# EAGLE design tastatur (EAGLE 6.3)
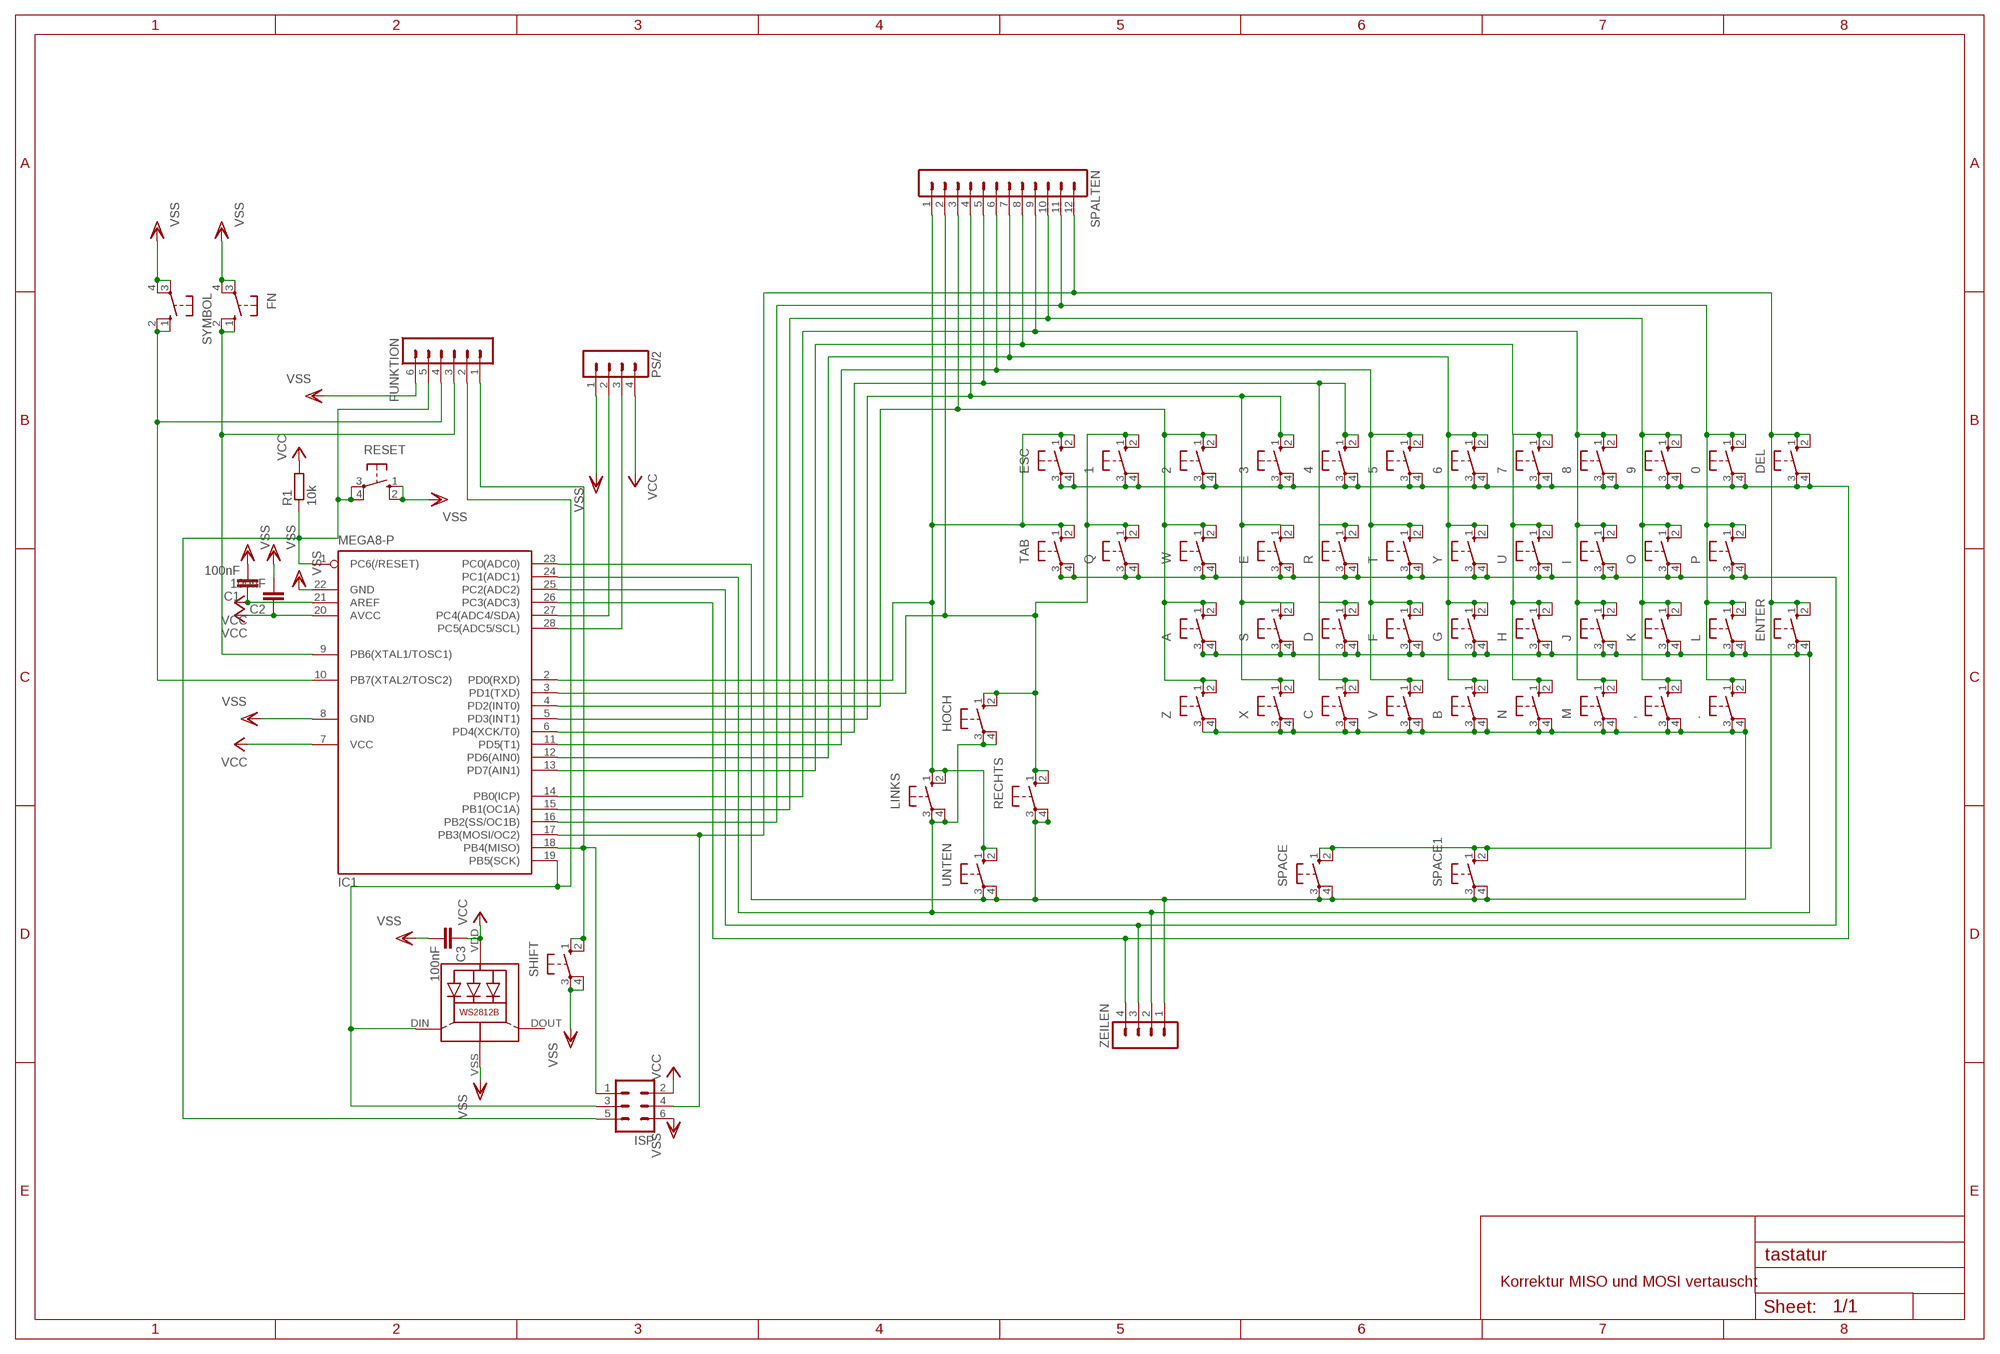
[diagram p0: schematic, sheet 1]

## Parts
0  40-XX  [B3F-40XX]
1  40-XX  [B3F-40XX]
2  40-XX  [B3F-40XX]
3  40-XX  [B3F-40XX]
4  40-XX  [B3F-40XX]
5  40-XX  [B3F-40XX]
6  40-XX  [B3F-40XX]
7  40-XX  [B3F-40XX]
8  40-XX  [B3F-40XX]
9  40-XX  [B3F-40XX]
,  40-XX  [B3F-40XX]
.  40-XX  [B3F-40XX]
A  40-XX  [B3F-40XX]
B  40-XX  [B3F-40XX]
C  40-XX  [B3F-40XX]
C1  100nF  C-EU025-025X050  [C025-025X050]
C2  100nF  C-EU025-025X050  [C025-025X050]
C3  100nF  C-EU025-025X050  [C025-025X050]
D  40-XX  [B3F-40XX]
DEL  40-XX  [B3F-40XX]
E  40-XX  [B3F-40XX]
ENTER  40-XX  [B3F-40XX]
ESC  40-XX  [B3F-40XX]
F  40-XX  [B3F-40XX]
FN  40-XX  [B3F-40XX]
FUNKTION  MA06-1  [MA06-1]
G  40-XX  [B3F-40XX]
H  40-XX  [B3F-40XX]
HOCH  40-XX  [B3F-40XX]
I  40-XX  [B3F-40XX]
IC1  MEGA8-P  [DIL28-3]
ISP  ML6L  [ML6L]
J  40-XX  [B3F-40XX]
K  40-XX  [B3F-40XX]
L  40-XX  [B3F-40XX]
LED1  WS2812B  [WS2812B]
LINKS  40-XX  [B3F-40XX]
M  40-XX  [B3F-40XX]
N  40-XX  [B3F-40XX]
O  40-XX  [B3F-40XX]
P  40-XX  [B3F-40XX]
PS/2  MA04-1  [MA04-1]
Q  40-XX  [B3F-40XX]
R  40-XX  [B3F-40XX]
R1  10k  R-EU_0204/7  [0204/7]
RECHTS  40-XX  [B3F-40XX]
RESET  10-XX  [B3F-10XX]
S  40-XX  [B3F-40XX]
SHIFT  40-XX  [B3F-40XX]
SPACE  40-XX  [B3F-40XX]
SPACE1  40-XX  [B3F-40XX]
SPALTEN  MA12-1  [MA12-1]
SYMBOL  40-XX  [B3F-40XX]
T  40-XX  [B3F-40XX]
TAB  40-XX  [B3F-40XX]
U  40-XX  [B3F-40XX]
UNTEN  40-XX  [B3F-40XX]
V  40-XX  [B3F-40XX]
W  40-XX  [B3F-40XX]
X  40-XX  [B3F-40XX]
Y  40-XX  [B3F-40XX]
Z  40-XX  [B3F-40XX]
ZEILEN  MA04-1  [MA04-1]

## Nets
A0: ,.3(P) ,.4(P1) ..3(P) ..4(P1) B.3(P) B.4(P1) C.3(P) C.4(P1) IC1.23(PC0(ADC0)) M.3(P) M.4(P1) N.3(P) N.4(P1) RECHTS.3(P) RECHTS.4(P1) SPACE1.3(P) SPACE1.4(P1) SPACE.3(P) SPACE.4(P1) UNTEN.3(P) UNTEN.4(P1) V.3(P) V.4(P1) X.3(P) X.4(P1) Z.3(P) Z.4(P1) ZEILEN.1
A1: A.3(P) A.4(P1) D.3(P) D.4(P1) ENTER.3(P) ENTER.4(P1) F.3(P) F.4(P1) G.3(P) G.4(P1) H.3(P) H.4(P1) HOCH.3(P) HOCH.4(P1) IC1.24(PC1(ADC1)) J.3(P) J.4(P1) K.3(P) K.4(P1) L.3(P) L.4(P1) LINKS.3(P) LINKS.4(P1) S.3(P) S.4(P1) ZEILEN.2
A2: E.3(P) E.4(P1) I.3(P) I.4(P1) IC1.25(PC2(ADC2)) O.3(P) O.4(P1) P.3(P) P.4(P1) Q.3(P) Q.4(P1) R.3(P) R.4(P1) T.3(P) T.4(P1) TAB.3(P) TAB.4(P1) U.3(P) U.4(P1) W.3(P) W.4(P1) Y.3(P) Y.4(P1) ZEILEN.3
A3: 0.3(P) 0.4(P1) 1.3(P) 1.4(P1) 2.3(P) 2.4(P1) 3.3(P) 3.4(P1) 4.3(P) 4.4(P1) 5.3(P) 5.4(P1) 6.3(P) 6.4(P1) 7.3(P) 7.4(P1) 8.3(P) 8.4(P1) 9.3(P) 9.4(P1) DEL.3(P) DEL.4(P1) ESC.3(P) ESC.4(P1) IC1.26(PC3(ADC3)) ZEILEN.4
CLK: IC1.27(PC4(ADC4/SDA)) PS/2.2
D0: ESC.1(S) ESC.2(S1) IC1.2(PD0(RXD)) LINKS.1(S) LINKS.2(S1) SPALTEN.1 TAB.1(S) TAB.2(S1) UNTEN.1(S) UNTEN.2(S1)
D1: 1.1(S) 1.2(S1) HOCH.1(S) HOCH.2(S1) IC1.3(PD1(TXD)) Q.1(S) Q.2(S1) RECHTS.1(S) RECHTS.2(S1) SPALTEN.2
D2: 2.1(S) 2.2(S1) A.1(S) A.2(S1) IC1.4(PD2(INT0)) SPALTEN.3 W.1(S) W.2(S1) Z.1(S) Z.2(S1)
D3: 3.1(S) 3.2(S1) E.1(S) E.2(S1) IC1.5(PD3(INT1)) S.1(S) S.2(S1) SPALTEN.4 X.1(S) X.2(S1)
D4: 4.1(S) 4.2(S1) C.1(S) C.2(S1) D.1(S) D.2(S1) IC1.6(PD4(XCK/T0)) R.1(S) R.2(S1) SPALTEN.5
D5: 5.1(S) 5.2(S1) F.1(S) F.2(S1) IC1.11(PD5(T1)) SPALTEN.6 T.1(S) T.2(S1) V.1(S) V.2(S1)
D6: 6.1(S) 6.2(S1) B.1(S) B.2(S1) G.1(S) G.2(S1) IC1.12(PD6(AIN0)) SPALTEN.7 Y.1(S) Y.2(S1)
D7: 7.1(S) 7.2(S1) H.1(S) H.2(S1) IC1.13(PD7(AIN1)) N.1(S) N.2(S1) SPALTEN.8 U.1(S) U.2(S1)
D8: 8.1(S) 8.2(S1) I.1(S) I.2(S1) IC1.14(PB0(ICP)) J.1(S) J.2(S1) M.1(S) M.2(S1) SPALTEN.9
D9: 9.1(S) 9.2(S1) ,.1(S) ,.2(S1) IC1.15(PB1(OC1A)) K.1(S) K.2(S1) O.1(S) O.2(S1) SPALTEN.10
D10: 0.1(S) 0.2(S1) ..1(S) ..2(S1) IC1.16(PB2(SS/OC1B)) L.1(S) L.2(S1) P.1(S) P.2(S1) SPALTEN.11
D11: DEL.1(S) DEL.2(S1) ENTER.1(S) ENTER.2(S1) IC1.17(PB3(MOSI/OC2)) ISP.4 SPACE1.1(S) SPACE1.2(S1) SPACE.1(S) SPACE.2(S1) SPALTEN.12
DAT: IC1.28(PC5(ADC5/SCL)) PS/2.3
DIN: FUNKTION.2 IC1.19(PB5(SCK)) ISP.3 LED1.DIN(DI)
FN: FN.1(S) FN.2(S1) FUNKTION.3 IC1.9(PB6(XTAL1/TOSC1))
RESET: FUNKTION.5 IC1.1(PC6(/RESET)) ISP.5 R1.1 RESET.3(P) RESET.4(P1)
SHIFT: FUNKTION.1 IC1.18(PB4(MISO)) ISP.1 SHIFT.1(S) SHIFT.2(S1)
SYMBOL: FUNKTION.4 IC1.10(PB7(XTAL2/TOSC2)) SYMBOL.1(S) SYMBOL.2(S1)
VCC: C1.1 C2.1 C3.1 IC1.7(VCC) IC1.20(AVCC) IC1.21(AREF) ISP.2 LED1.VDD PS/2.4 R1.2
VSS: C1.2 C2.2 C3.2 FN.3(P) FN.4(P1) FUNKTION.6 IC1.8(GND) IC1.22(GND) ISP.6 LED1.VSS(GND) PS/2.1 RESET.1(S) RESET.2(S1) SHIFT.3(P) SHIFT.4(P1) SYMBOL.3(P) SYMBOL.4(P1)
Unconnected: LED1.DOUT(DO)

## Notes on the sheet
- Korrektur MISO und MOSI vertauscht

## Library data of the parts
0 1-9 , . A B C D DEL E ENTER ESC F FN G H HOCH I J K L LINKS M N O P Q R RECHTS S SHIFT SPACE SPACE1 SYMBOL T TAB U UNTEN V W X Y Z = switch-omron:40-XX: OMRON SWITCH; MF: OMRON COMPONENTS USA; MPN: B3F-4000; OC_FARNELL: 176434; OC_NEWARK: 36K3105
C1-C3 = rcl:C-EU: CAPACITOR, European symbol
FUNKTION = con-lstb:MA06-1: PIN HEADER; OC_FARNELL: unknown; OC_NEWARK: unknown
IC1 = atmel:MEGA8-P: MICROCONTROLLER 8 Kbytes FLASH, 1 kbytes SRAM, 512 bytes EEPROM, USART, 4-channel 10 bit ADC, 2-channel 8 bit ADC Pin compatible with Atmega48, ATMega88, ATMega168 Source: avr.lbr; OC_FARNELL: unknown; OC_NEWARK: unknown
ISP = con-ml:ML6L: HARTING; OC_FARNELL: unknown; OC_NEWARK: unknown
LED1 = WS2812B:WS2812B: Features and Benefits  * Intelligent reverse connect protection, the power supply reverse connection does not damage the IC. * The control circuit and the LED share the only power source. Control circuit and RGB chip are integrated in a package of 5050 components, form a complete control of pixel point.  * Built-in signal reshaping circuit, after wave reshaping to the next driver, ensure wave-form distortion not accumulate.  * Built-in electric reset circuit and power lost reset circuit.  * Each pixel of the three primary color can achieve 256 brightness display, completed 16777216 color full color display, and scan frequency not less than 400Hz/s.  * Cascading port transmission signal by single line.  * Any two point the distance more than 5m transmission signal without any increase circuit.  * When the refresh rate is 30fps, cascade number are not less than1024 points.  * Send data at speeds of 800Kbps.  *The color of the light were highly consistent, cost-effective. Applications  Full-color module, Full color soft lights a lamp strip. LED decorative lighting, Indoor/outdoor LED video irregular screen. General description WS2812B is a intelligent control LED light source that the control circuit and RGB chip are integrated in a package of 5050 components. It internal include intelligent digital port data latch and signal reshaping amplification drive circuit. Also include a precision internal oscillator and a 12V voltage programmable constant curre-nt control part, effectively ensuring the pixel point light color height consistent. The data transfer protocol use single NZR communication mode. After the pixel power-on reset, the DIN port receive data from controller, the first pixel collect initial 24bit data then sent to the internal data latch, the other data which reshaping by the internal signal reshaping amplification circuit sent to the next cascade pixel through the DO port. After transmission for each pixel,the signal to reduce 24bit. pixel adopt auto reshaping transmit technology, making the pixel cascade number is not limited the signal transmission, only depend on the speed of signal transmission. LED with low driving voltage, environmental protection and energy saving, high brightness, scattering angle is large, good consistency, low power, long life and other advantages. The control chip integrated in LED above becoming more simple circuit, small volume, convenient installation. Absolute Maximum Ratings Power supply voltage: VDD +3.5V..+5.3V Input voltage: VI -0.5V..VDD+0.5V based on WS2812 from https://github.com/adafruit/Adafruit-Eagle-Library
PS/2 ZEILEN = con-lstb:MA04-1: PIN HEADER; OC_FARNELL: unknown; OC_NEWARK: unknown
R1 = rcl:R-EU_: RESISTOR, European symbol
RESET = switch-omron:10-XX: OMRON SWITCH; MPN: B3F-1000; OC_FARNELL: 176432; OC_NEWARK: 36M3542
SPALTEN = con-lstb:MA12-1: PIN HEADER; OC_FARNELL: unknown; OC_NEWARK: unknown

## Board
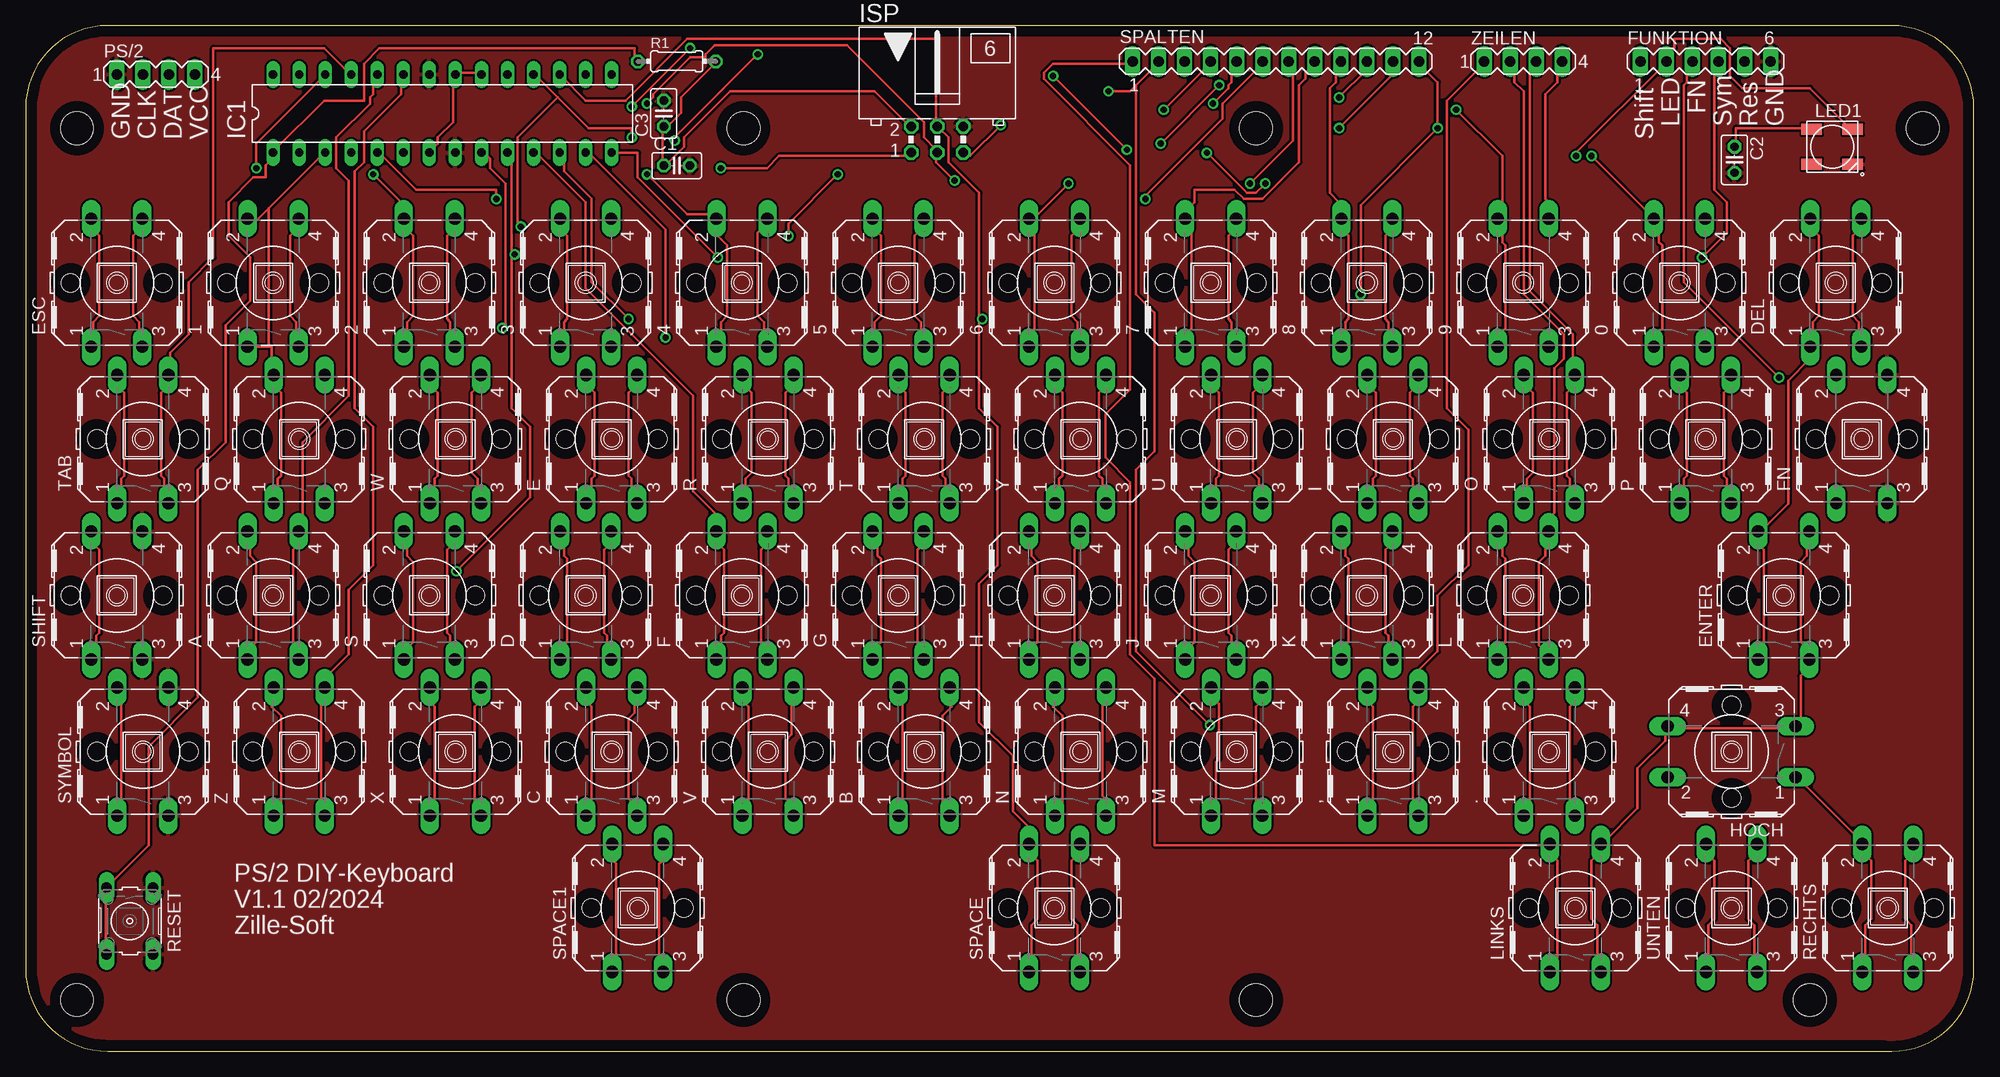
[diagram p1: board, top side]
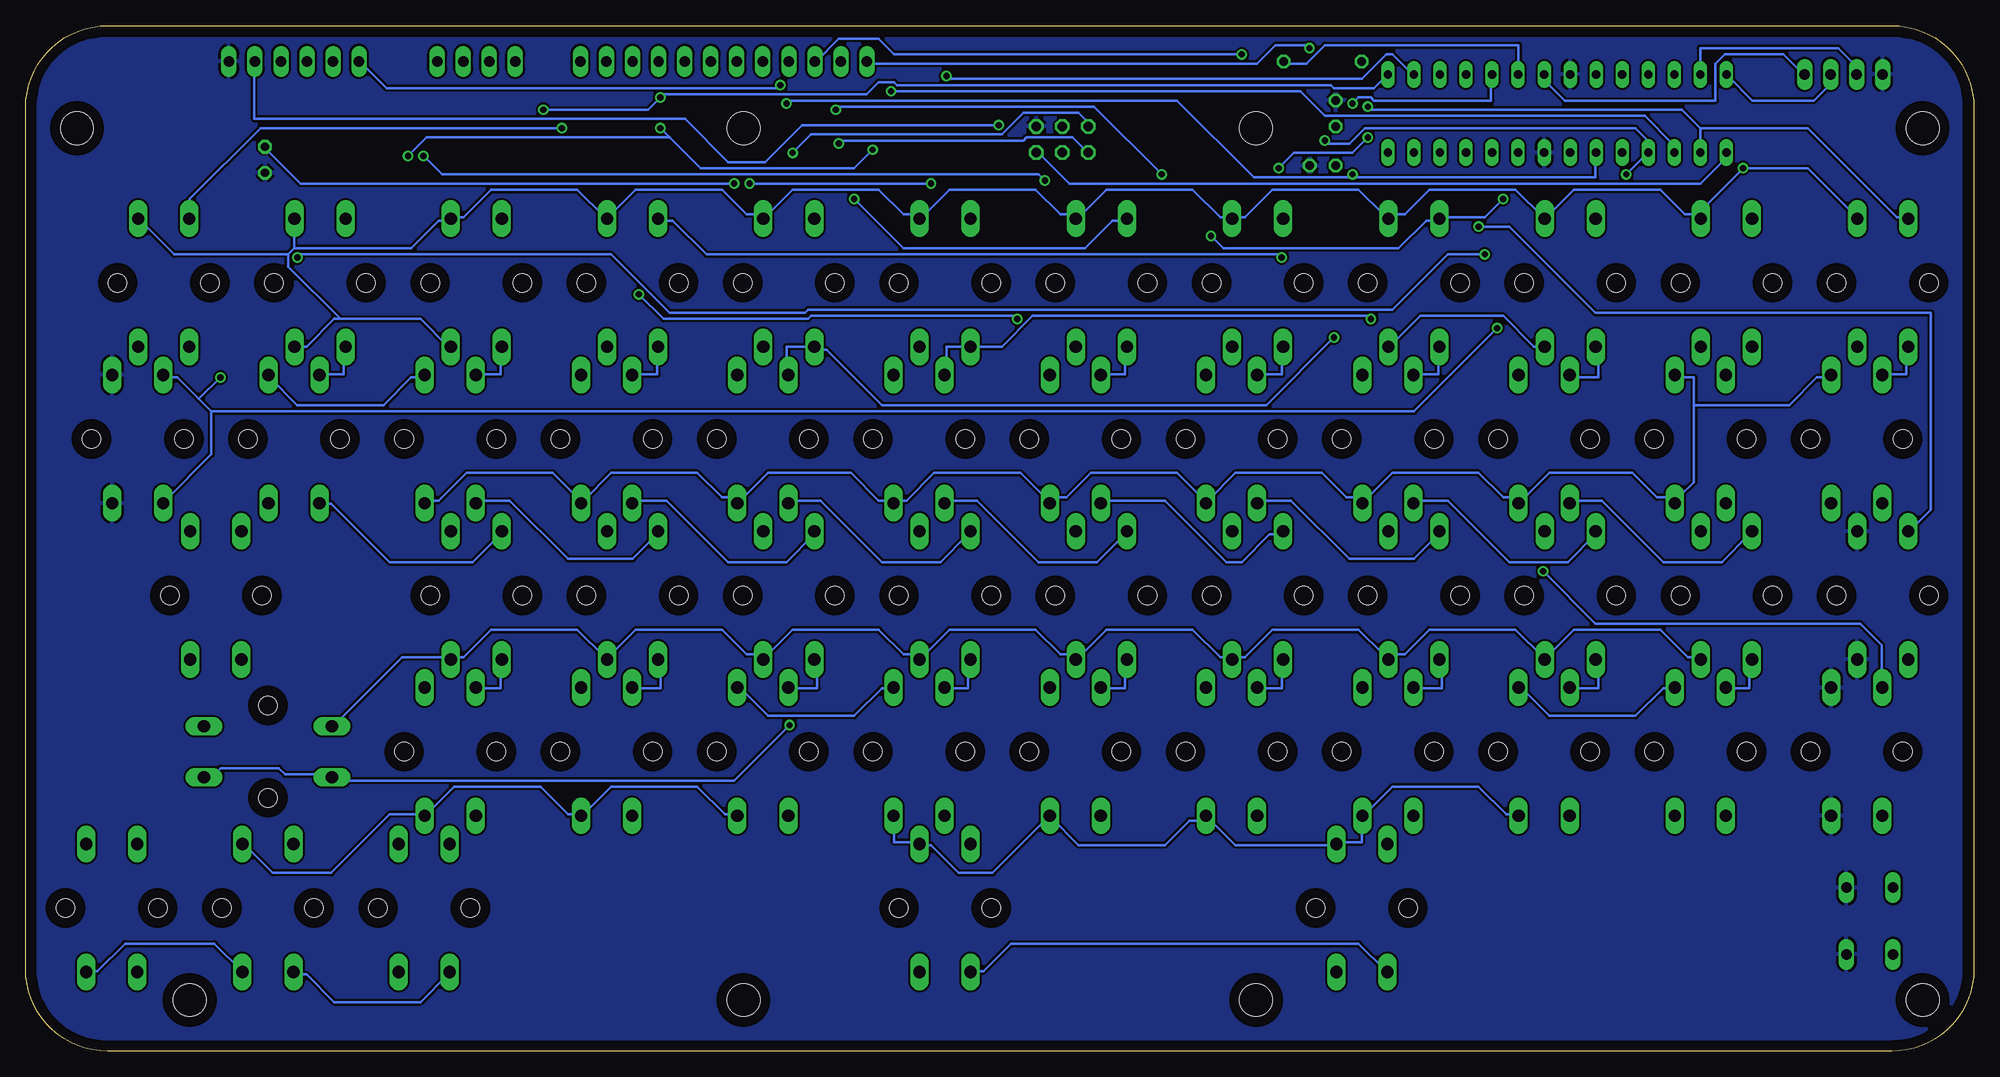
[diagram p2: board, bottom side, seen from below]

Size 190 x 100 mm. Coordinates in mm from the lower left corner, seen from the top.
Outline: 190,8 190,92 arc90 182,100 8,100 arc90 0,92 0,8 arc90 8,0 182,0 arc90 190,8
Copper layers (1*16): Top 0.035mm / dielectric 1.5mm / Bottom 0.035mm
Design rules "default": minimum track width 10mil, minimum drill 24mil, track to track 8mil, track to pad 8mil, pad to pad 8mil, via to via 8mil, smd to smd 8mil, copper to edge 40mil, drill to drill 8mil, minimum pad ring 10mil, minimum via ring 8mil, stop-mask expansion 4mil, vias tented up to drill 0mil, thermal gap 10mil
Holes 3.2 mm at 5,90 5,5 174,5 185,90 70,5 120,5 120,90 70,90

### Footprints (pad centres in the part's own frame; a part is rotated, then mirrored left to right if it is on the bottom)
B3F-40XX = drill 1.194 long: 1 -6.248,2.489; 2 6.248,2.489; 3 -6.248,-2.489; 4 6.248,-2.489 | hole 1.803: 0,-4.496; 0,4.496
C025-025X050 = drill 0.813 octagon: 1 -1.27,0; 2 1.27,0
MA06-1 = drill 1.016 long: 1 -6.35,0; 2 -3.81,0; 3 -1.27,0; 4 1.27,0; 5 3.81,0; 6 6.35,0
DIL28-3 = drill 0.813 long: 1 -16.51,-3.81; 2 -13.97,-3.81; 3 -11.43,-3.81; 4 -8.89,-3.81; 5 -6.35,-3.81; 6 -3.81,-3.81; 7 -1.27,-3.81; 8 1.27,-3.81; 9 3.81,-3.81; 10 6.35,-3.81; 11 8.89,-3.81; 12 11.43,-3.81; 13 13.97,-3.81; 14 16.51,-3.81; 15 16.51,3.81; 16 13.97,3.81; 17 11.43,3.81; 18 8.89,3.81; 19 6.35,3.81; 20 3.81,3.81; 21 1.27,3.81; 22 -1.27,3.81; 23 -3.81,3.81; 24 -6.35,3.81; 25 -8.89,3.81; 26 -11.43,3.81; 27 -13.97,3.81; 28 -16.51,3.81
ML6L = drill 0.914 octagon: 1 -2.54,-1.27; 2 -2.54,1.27; 3 0,-1.27; 4 0,1.27; 5 2.54,-1.27; 6 2.54,1.27
WS2812B = smd 2 x 1.1: DIN 2,1.7; DOUT -2,-1.7; VDD -2,1.7; VSS 2,-1.7
MA04-1 = drill 1.016 long: 1 -3.81,0; 2 -1.27,0; 3 1.27,0; 4 3.81,0
0204/7 = drill 0.813 octagon: 1 -3.81,0; 2 3.81,0
B3F-10XX = drill 1.016 long: 1 -3.251,2.261; 2 3.251,2.261; 3 -3.251,-2.261; 4 3.251,-2.261
MA12-1 = drill 1.016 long: 1 -13.97,0; 2 -11.43,0; 3 -8.89,0; 4 -6.35,0; 5 -3.81,0; 6 -1.27,0; 7 1.27,0; 8 3.81,0; 9 6.35,0; 10 8.89,0; 11 11.43,0; 12 13.97,0

### Placement (x,y rotation side)
0  161.29,74.93 90 top
1  24.13,74.93 90 top
2  39.37,74.93 90 top
3  54.61,74.93 90 top
4  69.85,74.93 90 top
5  85.09,74.93 90 top
6  100.33,74.93 90 top
7  115.57,74.93 90 top
8  130.81,74.93 90 top
9  146.05,74.93 90 top
,  133.35,29.21 90 top
.  148.59,29.21 90 top
A  24.13,44.45 90 top
B  87.63,29.21 90 top
C  57.15,29.21 90 top
C1  63.5,86.36 0 top
C2  166.65,86.92 270 top
C3  62.23,91.44 90 top
D  54.61,44.45 90 top
DEL  176.53,74.93 90 top
E  57.15,59.69 90 top
ENTER  171.45,44.45 90 top
ESC  8.89,74.93 90 top
F  69.85,44.45 90 top
FN  179.07,59.69 90 top
FUNKTION  163.83,96.52 0 top
G  85.09,44.45 90 top
H  100.33,44.45 90 top
HOCH  166.37,29.21 180 top
I  133.35,59.69 90 top
IC1  40.64,91.44 0 top
ISP  88.9,88.9 0 top
J  115.57,44.45 90 top
K  130.81,44.45 90 top
L  146.05,44.45 90 top
LED1  176.19,88.19 0 top
LINKS  151.13,13.97 90 top
M  118.11,29.21 90 top
N  102.87,29.21 90 top
O  148.59,59.69 90 top
P  163.83,59.69 90 top
PS/2  12.7,95.25 0 top
Q  26.67,59.69 90 top
R  72.39,59.69 90 top
R1  63.5,96.52 0 top
RECHTS  181.61,13.97 90 top
RESET  10.16,12.7 270 top
S  39.37,44.45 90 top
SHIFT  8.89,44.45 90 top
SPACE  100.33,13.97 90 top
SPACE1  59.69,13.97 90 top
SPALTEN  121.92,96.52 0 top
SYMBOL  11.43,29.21 90 top
T  87.63,59.69 90 top
TAB  11.43,59.69 90 top
U  118.11,59.69 90 top
UNTEN  166.37,13.97 90 top
V  72.39,29.21 90 top
W  41.91,59.69 90 top
X  41.91,29.21 90 top
Y  102.87,59.69 90 top
Z  26.67,29.21 90 top
ZEILEN  146.05,96.52 0 top

### Tracks (layer width: path | path; a pad name or v marks a point on that pad's centre or on a via)
A0
  Top 0.254: UNTEN.3 168.6,7.8 168.6,12.3 168,12.9 168,18.6 168.6,19.2 168.6,20.1 UNTEN.4 | RECHTS.3 183.9,7.8 183.9,12.3 183.3,12.9 183.3,18.6 183.9,19.2 183.9,20.1 RECHTS.4 | ..3 150.9,23.1 150.6,23.4 150.6,33.6 150.9,33.9 150.9,35.4 ..4 | ZEILEN.1 142.2,96.3 138.6,92.7 138.6,62.7 140.7,60.6 140.7,47.4 137.7,44.4 137.7,39 135.9,37.2 135.9,35.7 ,.4 135.6,35.4 135.6,33.9 135.3,33.6 135.3,23.4 135.6,23.1 ,.3 | M.3 120.3,23.1 120,23.4 120,33.6 120.3,33.9 120.3,35.4 M.4 | B.3 90,23.1 89.4,23.7 89.4,32.7 90.3,33.6 90.3,35.4 B.4 | SPACE.3 102.6,7.8 102.6,12.3 102,12.9 102,18.6 102.6,19.2 102.6,20.1 SPACE.4 | N.4 105.3,35.4 105,35.1 105,24.9 105.3,24.6 105.3,23.1 N.3 | SPACE1.3 62.1,7.8 61.8,8.1 61.8,18.3 62.1,18.6 62.1,20.1 SPACE1.4 | C.4 59.4,35.4 59.4,33 58.8,32.4 58.8,24.6 59.4,24 59.4,23.1 C.3 | V.4 74.7,35.4 74.7,30.9 74.1,30.3 74.1,24.6 74.7,24 74.7,23.1 V.3 | X.3 44.1,23.1 43.8,23.4 43.8,33.6 44.1,33.9 44.1,35.4 X.4 | IC1.23 36.6,95.1 36.6,93.3 33,89.7 33,86.7 32.1,85.8 32.1,62.7 33.9,60.9 33.9,47.4 31.5,45 31.5,38.7 29.4,36.6 29.4,35.7 Z.4 29.1,35.4 28.8,35.1 28.8,23.4 29.1,23.1 Z.3
  Bottom 0.254: UNTEN.3 168.9,7.8 171.6,10.5 180.3,10.5 183,7.8 183.9,7.8 RECHTS.3 | UNTEN.4 168.6,20.1 165.9,17.4 160.2,17.4 154.5,23.1 151.2,23.1 ..3 150.9,23.1 148.2,25.8 139.8,25.8 137.1,23.1 135.9,23.1 ,.3 135.6,23.1 132.9,25.8 124.5,25.8 121.8,23.1 120.6,23.1 M.3 | N.3 105.3,22.8 105.3,20.4 102.9,20.4 SPACE.4 102.6,20.1 101.7,20.1 99,17.4 95.7,17.4 90.3,22.8 B.3 90,22.8 87.3,20.1 78.9,20.1 76.5,22.5 74.4,22.5 | M.4 120.3,35.4 117.6,32.7 109.2,32.7 106.5,35.4 105.6,35.4 N.4 | 74.4,22.5 72,20.1 62.4,20.1 SPACE1.4 62.1,20.4 59.7,20.4 59.7,22.8 C.3 59.4,23.1 56.7,25.8 48.3,25.8 45.6,23.1 44.4,23.1 X.3 | 74.4,22.5 74.7,22.8 V.3 74.4,22.5 | X.4 44.1,35.4 41.4,32.7 33,32.7 30.3,35.4 29.4,35.4 Z.4
A1
  Top 0.254: ZEILEN.2 144.9,96.3 145.2,96 145.2,94.5 146.1,93.6 146.1,73.8 150,69.9 150,67.5 149.1,66.6 149.1,52.5 148.8,52.2 148.8,50.7 L.4 148.5,50.4 148.2,50.1 148.2,48.3 147.6,47.7 147.6,39.6 148.5,38.7 148.5,38.4 L.3 | ENTER.4 173.7,50.4 173.7,48.3 173.1,47.7 173.1,39.9 173.7,39.3 173.7,38.4 ENTER.3 173.7,38.1 173.7,37.2 173.1,36.6 173.1,32.1 172.8,31.8 HOCH.3 172.5,31.5 160.2,31.5 HOCH.4 159.9,31.5 159.9,30.3 157.2,27.6 157.2,23.7 153.9,20.4 LINKS.4 153.6,20.1 153.6,19.5 152.7,18.6 152.7,12.9 153.3,12.3 153.3,8.1 153.6,7.8 LINKS.3 | K.3 133.2,38.4 132.9,38.7 132.9,40.5 132.6,40.8 132.6,48.9 133.2,49.5 133.2,50.4 K.4 | S.3 41.7,38.4 41.4,38.7 41.4,40.5 41.1,40.8 41.1,48.9 41.7,49.5 41.7,50.4 S.4 | IC1.24 34.2,95.1 33.9,94.8 33.9,93.3 33.6,93 33.6,92.4 30.3,89.1 30.3,86.1 31.5,84.9 31.5,63.9 27,59.4 27,51 26.7,50.7 A.4 26.4,50.4 26.4,49.2 26.1,48.9 26.1,38.7 26.4,38.4 A.3 | J.3 117.9,38.4 117.6,38.7 117.6,40.5 117.3,40.8 117.3,48.9 117.9,49.5 117.9,50.4 J.4 | H.3 102.6,38.4 102.3,38.7 102.3,48.9 102.6,49.2 102.6,50.4 H.4 | G.3 87.3,38.4 87,38.7 87,48.9 87.3,49.2 87.3,50.4 G.4 | D.3 57,38.4 56.7,38.7 56.7,40.5 56.4,40.8 56.4,48.9 57,49.5 57,50.4 D.4 | F.3 72.3,38.4 71.7,39 71.7,48.9 72.3,49.5 72.3,50.4 F.4
  Bottom 0.254: HOCH.4 159.9,31.8 153.3,38.4 148.8,38.4 L.3 148.5,38.4 147.3,38.4 144.6,41.1 136.2,41.1 133.5,38.4 K.3 133.2,38.4 130.5,41.1 122.1,41.1 119.7,38.7 117.6,38.7 | A.3 26.7,38.4 27.9,38.4 30.6,41.1 39,41.1 41.7,38.4 S.3 42,38.4 44.7,41.1 53.1,41.1 55.5,38.7 57.6,38.7 | 57.6,38.7 60,41.1 68.4,41.1 71.1,38.4 72.3,38.4 F.3 72.6,38.4 73.5,38.4 76.2,41.1 84.6,41.1 87,38.7 | 57.6,38.7 57.3,38.4 D.3 57.6,38.7 | 87,38.7 87.3,38.4 G.3 87,38.7 | 102.3,38.7 99.9,41.1 91.5,41.1 89.1,38.7 87,38.7 | 102.3,38.7 102.6,38.4 H.3 102.3,38.7 | 117.6,38.7 115.2,41.1 106.8,41.1 104.4,38.7 102.3,38.7 | 117.6,38.7 117.9,38.4 J.3 117.6,38.7
A2
  Top 0.254: R.3 74.7,53.7 74.4,54 74.4,55.8 74.1,56.1 74.1,64.2 74.7,64.8 74.7,65.7 R.4 | E.3 59.4,53.7 59.1,54 59.1,55.8 58.8,56.1 58.8,64.2 59.4,64.8 59.4,65.7 E.4 | W.3 44.1,53.7 44.1,55.8 43.5,56.4 43.5,64.2 44.1,64.8 44.1,65.7 W.4 | IC1.25 31.5,95.4 29.1,97.8 18.3,97.8 18.3,77.4 15.9,75 15.9,69.9 14.1,68.1 14.1,66 TAB.4 13.8,65.7 13.8,64.8 13.2,64.2 13.2,56.1 13.5,55.8 13.5,54 13.8,53.7 TAB.3 | I.3 135.6,53.7 135.3,54 135.3,55.8 135,56.1 135,64.2 135.6,64.8 135.6,65.7 I.4 | U.3 120.3,53.7 120.3,55.8 119.7,56.4 119.7,64.2 120.3,64.8 120.3,65.7 U.4 | T.3 90,53.7 89.7,54 89.7,55.8 89.4,56.1 89.4,64.2 90,64.8 90,65.7 T.4 | Y.3 105.3,53.7 105,54 105,55.8 104.7,56.1 104.7,64.2 105.3,64.8 105.3,65.7 Y.4 | P.3 166.2,53.7 165.9,54 165.9,55.8 165.6,56.1 165.6,64.2 166.2,64.8 166.2,65.7 P.4 | ZEILEN.3 147.3,96.3 146.7,95.7 146.7,74.1 150.9,69.9 150.9,66 O.4 150.9,65.7 150.9,64.8 150.3,64.2 150.3,56.1 150.6,55.8 150.6,54 150.9,53.7 O.3
  Bottom 0.254: 28.8,54 27.3,55.5 27.3,63 | 28.8,54 29.1,53.7 Q.3 28.8,54 | 27.3,63 27.3,65.7 29.1,65.7 Q.4 | 27.3,63 18,63 15.3,65.7 14.1,65.7 TAB.4 | 43.8,54 41.4,56.4 33.3,56.4 30.9,54 28.8,54 | 43.8,54 44.1,53.7 W.3 43.8,54 | 59.1,54 56.7,56.4 48.3,56.4 45.9,54 43.8,54 | 59.1,54 59.4,53.7 E.3 59.1,54 | 59.1,54 61.2,54 63.6,56.4 72,56.4 74.7,53.7 R.3 75,53.7 77.7,56.4 86.1,56.4 88.5,54 90.6,54 | 90.6,54 93,56.4 101.4,56.4 104.1,53.7 105.3,53.7 Y.3 105.6,53.7 106.8,53.7 109.5,56.4 117.6,56.4 120,54 | 90.6,54 90.3,53.7 T.3 90.6,54 | 120,54 120.3,53.7 U.3 120,54 | 120,54 122.1,54 124.5,56.4 132.9,56.4 135.6,53.7 I.3 135.9,53.7 138.6,56.4 147,56.4 149.7,53.7 150.9,53.7 O.3 | P.4 166.2,65.7 163.5,63 155.1,63 152.4,65.7 151.2,65.7 O.4
A3  (via drill 0.61)
  Top 0.254: DEL.3 178.8,68.7 178.8,71.1 178.2,71.7 178.2,79.5 178.8,80.1 178.8,81 DEL.4 | 8.3 133.2,68.7 132.9,69 132.9,71.1 132.6,71.4 132.6,79.5 133.2,80.1 133.2,81 8.4 | ZEILEN.4 149.7,96.3 149.4,96 149.4,94.5 148.2,93.3 148.2,83.1 148.5,82.8 148.5,81.3 9.4 | 2.3 41.7,68.7 41.4,69 41.4,71.1 41.1,71.4 41.1,79.5 41.7,80.1 41.7,81 2.4 | ESC.3 11.1,68.7 11.1,71.1 10.5,71.7 10.5,79.5 11.1,80.1 11.1,81 ESC.4 | v22.5,86.1 22.5,88.5 29.1,95.1 IC1.26 | 1.3 26.4,68.7 26.4,71.1 25.8,71.7 25.8,79.5 26.4,80.1 26.4,81 1.4 | 7.3 117.9,68.7 117.6,69 117.6,71.1 117.3,71.4 117.3,79.5 117.9,80.1 117.9,81 7.4 | 6.3 102.6,68.7 102.6,71.1 102,71.7 102,79.5 102.6,80.1 102.6,81 6.4 | 5.3 87.3,68.7 87.3,71.1 86.7,71.7 86.7,79.5 87.3,80.1 87.3,81 5.4 | 4.3 72.3,68.7 72,69 72,71.1 71.4,71.7 71.4,79.8 72.3,80.7 72.3,81 4.4
  Bottom 0.254: 159.3,71.4 159.9,71.4 162.6,68.7 163.5,68.7 0.3 | 159.3,71.4 151.5,71.4 148.8,68.7 9.3 | 163.8,78.3 163.8,81 0.4 | 164.4,77.7 163.8,78.3 | 164.4,77.7 164.4,76.5 159.3,71.4 | 164.4,77.7 175.5,77.7 178.8,81 DEL.4 | 163.8,78.3 152.4,78.3 149.7,81 148.8,81 9.4 148.5,81.3 147.3,81.3 144.6,84 136.2,84 133.5,81.3 8.4 133.2,81.3 130.5,84 122.1,84 119.7,81.6 117.6,81.6 | 3.3 57,68.7 54,71.7 45.9,71.7 42.9,68.7 42,68.7 2.3 | 26.4,81.6 26.4,81.3 1.4 26.4,81.6 | 26.4,81.6 26.4,82.2 v22.5,86.1 16.2,86.1 11.4,81.3 ESC.4 | 26.4,81.6 28.2,81.6 30.6,84 39,84 41.7,81.3 2.4 42,81.3 44.7,84 53.1,84 55.5,81.6 57.6,81.6 | 57.6,81.6 60,84 68.4,84 71.1,81.3 72.3,81.3 4.4 72.6,81.3 73.5,81.3 76.2,84 84.6,84 87,81.6 | 57.6,81.6 57.3,81.3 3.4 57.6,81.6 | 87,81.6 87.3,81.3 5.4 87,81.6 | 102.3,81.6 99.9,84 91.5,84 89.1,81.6 87,81.6 | 102.3,81.6 102.6,81.3 6.4 102.3,81.6 | 117.6,81.6 115.2,84 106.8,84 104.4,81.6 102.3,81.6 | 117.6,81.6 117.9,81.3 7.4 117.6,81.6
CLK
  Bottom 0.254: IC1.27 26.7,95.4 26.7,97.8 13.2,97.8 11.7,96.3 11.7,95.4 PS/2.2
D0  (via drill 0.61)
  Top 0.254: LINKS.1 148.8,7.8 149.4,8.4 149.4,18.6 148.8,19.2 148.8,20.1 LINKS.2 148.5,20.1 110.1,20.1 110.1,36.3 107.7,38.7 107.7,55.5 105.3,57.9 105.3,62.1 107.7,64.5 107.7,86.4 99.3,94.8 99.3,95.4 100.2,96.3 107.7,96.3 SPALTEN.1 | UNTEN.1 164.1,7.8 164.1,12.3 164.7,12.9 164.7,18.6 164.1,19.2 164.1,20.1 UNTEN.2 | TAB.1 9,53.7 9.3,54 9.3,55.8 9.6,56.1 9.6,64.2 9,64.8 9,65.7 TAB.2 | v59.1,92.1 v64.8,97.8 | ESC.1 6.6,68.7 6.6,71.1 7.2,71.7 7.2,79.5 6.6,80.1 6.6,81 ESC.2
  Bottom 0.254: LINKS.1 148.8,7.5 151.5,4.8 159.9,4.8 162.6,7.5 163.8,7.5 UNTEN.1 | ESC.1 6.6,68.4 6.6,66 8.7,66 TAB.2 | 26.7,90 26.7,87.9 IC1.2 | 26.7,90 16.2,90 7.5,81.3 6.6,81.3 ESC.2 | v64.8,97.8 65.1,98.1 68.1,98.1 69.9,96.3 107.7,96.3 SPALTEN.1 | v59.1,92.1 58.8,91.8 28.5,91.8 26.7,90
D1  (via drill 0.61)
  Top 0.254: RECHTS.1 179.4,7.8 179.4,12.3 180,12.9 180,18.6 179.4,19.2 179.4,20.1 RECHTS.2 179.1,20.4 172.8,26.7 HOCH.1 | Q.1 24.3,53.7 24.6,54 24.6,55.8 24.9,56.1 24.9,64.2 24.3,64.8 24.3,65.7 Q.2 24,66 24,68.7 23.7,68.7 | 23.7,68.7 21.9,68.7 1.1 | 23.7,82.2 22.5,81 21.9,81 1.2 | 23.7,82.2 29.1,87.6 IC1.3 | 108.3,94.2 107.7,93.6 v105.6,93.6 | 108.3,94.2 110.4,96.3 SPALTEN.2 | 23.7,82.2 23.7,68.7 | v115.5,31.8 108.3,39 108.3,56.7 110.1,58.5 110.1,72 108.3,73.8 108.3,94.2
  Bottom 0.254: HOCH.1 172.5,27 171.6,27 171,27.6 165.3,27.6 164.7,27 160.2,27 HOCH.2 159.9,26.7 159.6,26.4 120.9,26.4 v115.5,31.8 | v105.6,93.6 65.7,93.6 63.3,91.2 32.1,91.2 29.4,88.5 29.4,87.9 IC1.3
D2  (via drill 0.61)
  Top 0.254: Z.1 24.3,23.1 24.9,23.7 24.9,32.7 24,33.6 24,35.4 Z.2 | A.2 21.9,50.4 21.9,48.3 22.5,47.7 22.5,39.9 21.9,39.3 21.9,38.4 A.1 | W.1 39.6,53.7 39.9,54 39.9,55.8 40.2,56.1 40.2,64.2 39.6,64.8 39.6,65.7 W.2 | v33.9,85.5 36.6,82.8 36.6,81.3 2.2 36.9,81 36.9,80.4 37.8,79.5 37.8,71.7 37.2,71.1 37.2,69 36.9,68.7 2.1 | v71.4,97.2 63.3,89.1 v63.3,88.8
  Bottom 0.254: A.1 21.9,38.1 21.9,35.4 24,35.4 Z.2 | 2.1 36.6,68.4 36.6,65.7 39.3,65.7 W.2 | v33.9,85.5 31.8,87.6 IC1.4 31.8,87.9 31.8,88.8 33,90 59.4,90 60.9,88.5 63,88.5 v63.3,88.8 | v71.4,97.2 105.3,97.2 106.8,98.7 110.7,98.7 112.8,96.6 SPALTEN.3 | A.2 21.9,50.4 24.6,47.7 30.3,47.7 36.3,53.7 39.3,53.7 W.1
D3  (via drill 0.61)
  Top 0.254: X.1 39.6,23.1 39.9,23.4 39.9,33.6 39.6,33.9 39.6,35.4 X.2 | S.2 36.9,50.4 37.2,50.1 37.2,48.3 37.8,47.7 37.8,39.9 36.9,39 36.9,38.4 S.1 | E.1 54.9,53.7 55.2,54 55.2,55.8 55.5,56.1 55.5,64.2 54.9,64.8 54.9,65.7 E.2 | v45.9,83.1 45.9,84 38.1,84 34.5,87.6 IC1.5 | v111,91.8 115.5,96.3 SPALTEN.4 | v79.2,85.5 74.4,80.7 v74.4,79.5 | 3.1 52.2,68.7 52.5,69 52.5,71.1 52.8,71.4 52.8,79.5 52.2,80.1 52.2,81 3.2
  Bottom 0.254: S.1 36.6,38.1 36.6,35.4 39.3,35.4 X.2 | 3.1 52.2,68.4 52.2,66 54.6,66 E.2 | v45.9,83.1 47.7,81.3 51.9,81.3 3.2 52.2,81 53.4,81 56.1,78.3 73.2,78.3 v74.4,79.5 | v111,91.8 110.7,92.1 85.8,92.1 v79.2,85.5 | S.2 36.9,50.4 39.6,47.7 45.3,47.7 51.3,53.7 54.6,53.7 E.1
D4  (via drill 0.61)
  Top 0.254: C.1 54.9,23.1 55.2,23.4 55.2,33.6 54.9,33.9 54.9,35.4 C.2 | D.2 52.2,50.4 52.5,50.1 52.5,48.3 52.8,48 52.8,39.9 52.2,39.3 52.2,38.4 D.1 | R.1 70.2,53.7 70.2,55.8 70.8,56.4 70.8,64.2 70.2,64.8 70.2,65.7 R.2 | v60.6,85.5 64.5,81.6 67.2,81.6 67.2,81.3 4.2 67.2,81 67.2,79.8 68.4,78.6 68.4,71.7 67.8,71.1 67.8,69 67.5,68.7 4.1 | v115.8,92.4 117.3,93.9 117.3,94.2 117.6,94.5 117.6,96 117.9,96.3 SPALTEN.5
  Bottom 0.254: D.1 51.9,38.1 51.9,35.4 54.6,35.4 C.2 | 4.1 67.5,68.4 67.5,66 69.9,66 R.2 | 60.3,85.2 36.9,85.2 36.9,87.6 IC1.6 | v115.8,92.4 115.5,92.7 77.7,92.7 70.2,85.2 60.3,85.2 | 60.3,85.2 v60.6,85.5 | D.2 52.2,50.4 54.6,48 60.9,48 66.6,53.7 69.9,53.7 R.1
D5  (via drill 0.61)
  Top 0.254: T.1 85.2,53.7 85.5,54 85.5,55.8 85.8,56.1 85.8,64.2 85.2,64.8 85.2,65.7 T.2 | v109.2,83.1 109.2,83.4 116.7,90.9 116.7,92.4 120.6,96.3 SPALTEN.6 | 5.1 82.8,68.7 82.8,71.1 83.4,71.7 83.4,79.5 82.8,80.1 82.8,81 5.2 | V.1 70.2,23.1 70.5,23.4 70.5,33.6 70.2,33.9 70.2,35.4 V.2 | IC1.11 49.8,87.6 54.6,82.8 54.6,74.4 65.1,63.9 65.1,54.6 67.2,52.5 67.2,50.7 F.2 67.5,50.4 67.5,49.5 68.1,48.9 68.1,40.8 67.8,40.5 67.8,38.7 67.5,38.4 F.1
  Bottom 0.254: 5.1 82.8,68.4 82.8,66 84.9,66 T.2 | v109.2,83.1 104.4,78.3 86.7,78.3 84,81 82.8,81 5.2 | F.1 67.5,38.1 67.5,35.4 69.9,35.4 V.2 | T.1 84.9,53.7 78.9,53.7 72.9,47.7 71.4,47.7 68.7,50.4 67.5,50.4 F.2
D6  (via drill 0.61)
  Top 0.254: v119.4,84.6 123.6,88.8 123.6,96 123.3,96.3 SPALTEN.7 | 98.1,81 v101.7,84.6 | B.1 85.2,23.1 85.5,23.4 85.5,35.1 85.2,35.4 B.2 | G.2 82.8,50.4 83.1,50.1 83.1,48.3 83.4,48 83.4,39.9 82.8,39.3 82.8,38.4 G.1 | Y.1 100.5,53.7 100.8,54 100.8,55.8 101.1,56.1 101.1,64.2 100.5,64.8 100.5,65.7 Y.2 | v58.8,71.4 55.2,75 55.2,83.1 52.5,85.8 52.5,87.3 52.2,87.6 IC1.12 | 98.1,81 98.4,80.7 98.4,70.5 98.1,70.2 98.1,68.7 6.1 | 98.1,81 6.2
  Bottom 0.254: v101.7,84.6 v119.4,84.6 | G.1 82.8,38.1 82.8,35.4 84.9,35.4 B.2 | v58.8,71.4 59.1,71.7 91.8,71.7 94.8,68.7 97.8,68.7 6.1 98.1,68.7 100.2,68.7 100.2,66 Y.2 | G.2 82.8,50.4 85.5,47.7 91.2,47.7 97.2,53.7 100.2,53.7 Y.1
D7  (via drill 0.61)
  Top 0.254: N.1 100.5,23.1 101.1,23.7 101.1,32.7 100.2,33.6 100.2,35.4 N.2 | H.2 98.1,50.4 98.1,48.3 98.7,47.7 98.7,39.9 98.1,39.3 98.1,38.4 H.1 | SPALTEN.8 125.7,96.3 124.8,95.4 124.8,94.8 124.2,94.2 124.2,86.7 120.6,83.1 118.8,83.1 117.9,84 114,84 114,82.8 113.1,81.9 113.1,81.3 7.2 113.1,81 113.7,80.4 113.7,70.5 113.1,69.9 113.1,68.7 7.1 | U.1 115.8,53.7 116.1,54 116.1,55.8 116.4,56.1 116.4,64.2 115.8,64.8 115.8,65.7 U.2 | v62.4,69.6 62.4,80.1 54.9,87.6 IC1.13
  Bottom 0.254: H.1 98.1,38.1 98.1,35.4 100.2,35.4 N.2 | v62.4,69.6 69,63 106.5,63 111.9,68.4 112.8,68.4 7.1 113.1,68.7 115.8,68.7 115.8,66 U.2 | H.2 98.1,50.4 100.8,47.7 106.5,47.7 112.5,53.7 115.5,53.7 U.1
D8  (via drill 0.61)
  Top 0.254: M.1 115.8,23.1 116.1,23.4 116.1,28.2 116.4,28.5 116.4,33.9 115.8,34.5 115.8,35.4 M.2 | J.2 113.1,50.4 113.4,50.1 113.4,48.3 114,47.7 114,39.9 113.1,39 113.1,38.4 J.1 | I.1 131.1,53.7 131.4,54 131.4,55.8 131.7,56.1 131.7,64.2 131.1,64.8 131.1,65.7 I.2 | v67.5,77.4 59.7,85.2 59.7,87.6 57.3,87.6 IC1.14 | SPALTEN.9 128.1,96.3 127.8,96 127.8,94.5 127.2,93.9 127.2,83.7 128.1,82.8 128.1,81.3 8.2 128.4,81 128.4,80.1 129,79.5 129,71.4 128.7,71.1 128.7,69 128.4,68.7 8.1
  Bottom 0.254: J.1 112.8,38.1 112.8,35.4 115.5,35.4 M.2 | 8.1 128.4,68.4 128.4,66 130.8,66 I.2 | v67.5,77.4 67.8,77.7 123.6,77.7 126.9,81 128.1,81 8.2 | J.2 113.1,50.4 115.8,47.7 121.5,47.7 127.5,53.7 130.8,53.7 I.1
D9  (via drill 0.61)
  Top 0.254: v128.1,93 130.8,95.7 130.8,96.3 SPALTEN.10 | ,.1 131.1,23.1 131.4,23.4 131.4,33.6 131.1,33.9 131.1,35.4 ,.2 | K.2 128.4,50.4 128.7,50.1 128.7,48.3 129,48 129,39.9 128.4,39.3 128.4,38.4 K.1 | 144,80.7 143.7,81 9.2 144,80.7 | 144,80.7 144,78.9 144.3,78.6 144.3,70.5 143.7,69.9 143.7,68.7 9.1 | O.1 146.4,53.7 146.4,55.8 147,56.4 147,64.2 146.4,64.8 146.4,65.7 O.2 | v139.5,91.8 144,87.3 144,80.7
  Bottom 0.254: IC1.15 58.5,93.9 62.4,93.9 62.7,94.2 105,94.2 105.3,94.5 106.8,94.5 108,93.3 127.8,93.3 v128.1,93 129.3,91.8 v139.5,91.8 | K.1 128.1,38.1 128.1,35.4 130.8,35.4 ,.2 | 9.1 143.7,68.4 143.7,66 146.1,66 O.2 | K.2 128.4,50.4 130.8,48 137.1,48 142.8,53.7 146.1,53.7 O.1
D10  (via drill 0.61)
  Top 0.254: ..1 146.4,23.1 146.7,23.4 146.7,33.6 146.4,33.9 146.4,35.4 ..2 | L.2 143.7,50.4 144,50.1 144,48.3 144.3,48 144.3,39.9 143.7,39.3 143.7,38.4 L.1 | P.1 161.4,53.7 161.7,54 161.7,55.8 162,56.1 162,64.2 161.4,64.8 161.4,65.7 P.2 | 0.1 159,68.7 159,69.9 159.6,70.5 159.6,78.6 159.3,78.9 159.3,80.7 159,81 0.2 158.7,81.3 v152.7,87.3 | v107.4,87.9 v100.2,95.1 | v128.1,90 133.2,95.1 133.2,96.3 SPALTEN.11
  Bottom 0.254: L.1 143.7,38.1 143.7,35.4 146.1,35.4 ..2 | 0.1 159,68.4 159,66 161.1,66 P.2 | L.2 143.7,50.4 146.4,47.7 154.5,47.7 160.2,53.4 161.1,53.4 P.1 | v100.2,95.1 99.9,94.8 59.7,94.8 57.3,97.2 56.7,97.2 54.9,95.4 IC1.16 | v107.4,87.9 109.2,86.1 124.2,86.1 127.2,89.1 | v128.1,90 127.2,89.1 | v152.7,87.3 150.9,89.1 127.2,89.1
D11  (via drill 0.61)
  Top 0.254: ENTER.1 169.2,38.4 169.5,38.7 169.5,48.9 169.2,49.2 169.2,50.4 ENTER.2 169.2,50.7 171.9,53.4 171.9,65.4 174,67.5 174,68.4 DEL.1 174.3,68.7 174.3,71.1 174.9,71.7 174.9,79.5 174.3,80.1 174.3,81 DEL.2 | SPALTEN.12 135.9,96.3 137.7,94.5 v137.7,90 130.2,82.5 v130.2,73.8 | IC1.17 52.2,95.1 54.6,92.7 58.5,92.7 64.5,98.7 88.8,98.7 88.8,90.3 ISP.4 89.1,90 90,89.1 90,86.7 93,83.7 93,71.4 | SPACE1.1 57.3,7.8 57.6,8.1 57.6,18.3 57.3,18.6 57.3,20.1 SPACE1.2 | SPACE.1 98.1,7.8 98.1,12.3 98.7,12.9 98.7,18.6 98.1,19.2 98.1,20.1 SPACE.2 97.8,20.4 97.8,21.9 96.3,23.4 96.3,28.8 93,32.1 93,45.6 94.8,47.4 94.8,60.9 93,62.7 93,71.4 | 93,71.4 v93.3,71.4
  Bottom 0.254: v137.7,90 167.1,90 174,83.1 174,81.3 DEL.2 | SPACE1.1 57.3,7.8 60,10.5 93.9,10.5 96.6,7.8 97.8,7.8 SPACE.1 | v130.2,73.8 127.8,71.4 113.7,71.4 113.4,71.7 93.6,71.7 v93.3,71.4
DAT
  Bottom 0.254: IC1.28 24,95.1 21.6,92.7 15.6,92.7 14.1,94.2 14.1,95.1 PS/2.3
DIN  (via drill 0.61)
  Top 0.254: LED1.DIN 177.9,90 174,93.9 167.4,93.9 166.2,95.1 166.2,97.8 165.3,98.7 160.8,98.7 160.8,97.8 160.2,97.2 160.2,96.6 FUNKTION.2 159.9,96.3 151.2,87.6 v151.2,87.3 | v60.6,92.4 61.2,93 61.2,93.3 64.8,96.9 66.3,96.9 66.3,97.2 67.2,98.1 80.1,98.1 87.6,90.6 87.6,89.1 88.8,87.9 ISP.3 88.8,87.6 88.8,86.7 v90.6,84.9
  Bottom 0.254: v60.6,92.4 60,93 58.8,93 58.5,92.7 47.1,92.7 47.1,95.1 IC1.19 | v151.2,87.3 149.4,85.5 91.2,85.5 v90.6,84.9
FN  (via drill 0.61)
  Top 0.254: v46.5,70.5 46.8,70.8 46.8,84.6 45.3,86.1 45.3,87 44.7,87.6 IC1.9 | v171,65.7 161.7,75 161.7,94.2 162,94.5 162,96 162.3,96.3 FUNKTION.3
  Bottom 0.254: v46.5,70.5 54.6,62.4 171.9,62.4 | 173.1,63.6 175.2,65.7 176.4,65.7 FN.2 | 173.1,63.6 171.9,62.4 | 173.1,63.6 v171,65.7 | 171.9,62.4 171.9,58.2 176.4,53.7 FN.1
RESET  (via drill 0.61)
  Top 0.254: RESET.4 7.8,9.6 7.8,15.9 RESET.3 8.1,16.2 12,20.1 12,29.7 16.8,34.5 16.8,56.7 19.5,59.4 19.5,70.8 21.9,73.2 21.9,77.4 19.8,79.5 19.8,82.8 22.2,85.2 23.4,85.2 23.4,86.4 24,87 24,87.6 IC1.1 24.3,87.9 29.1,92.7 33,92.7 33,96.3 34.5,97.8 59.4,97.8 59.4,96.6 R1.1 | v95.1,90.3 92.1,87.3 91.5,87.3 91.5,87.6 ISP.5
  Bottom 0.254: ISP.5 91.2,87.6 88.2,84.6 26.7,84.6 24.6,86.7 24.6,87.6 24.3,87.6 IC1.1 | v95.1,90.3 114.3,90.3 117.9,86.7 121.5,86.7 125.7,90.9 167.7,90.9 167.7,96.3 FUNKTION.5
SHIFT  (via drill 0.61)
  Top 0.254: SHIFT.1 6.6,38.4 6.9,38.7 6.9,40.5 7.2,40.8 7.2,48.9 6.6,49.5 6.6,50.4 SHIFT.2 | 51.9,93 54.9,90 59.1,90 v59.1,89.1 | 51.9,93 49.8,95.1 IC1.18 | v67.8,86.1 72.3,86.1 73.5,87.3 86.1,87.3 86.1,87.6 ISP.1 | v110.7,88.5 v116.4,94.2 | v48.3,80.4 48,80.7 48,89.1 51.9,93
  Bottom 0.254: v59.1,89.1 60.6,87.6 66.3,87.6 v67.8,86.1 | v116.4,94.2 116.7,93.9 154.8,93.9 157.2,96.3 FUNKTION.1 | v110.7,88.5 110.4,88.8 92.7,88.8 92.4,89.1 87.9,89.1 86.7,87.9 86.4,87.9 ISP.1 | v48.3,80.4 45.3,80.4 36.9,72 4.2,72 4.2,52.8 6.3,50.7 SHIFT.2
SYMBOL  (via drill 0.61)
  Top 0.254: 47.4,77.7 47.4,62.7 49.2,60.9 49.2,54 v42,46.8 | 47.4,77.7 47.4,87.3 47.1,87.6 IC1.10 | v163.5,77.4 165.9,79.8 165.9,82.8 164.7,84 164.7,96 165,96.3 FUNKTION.4 | 47.4,77.7 v47.7,77.7 | SYMBOL.1 9,23.1 9.3,23.4 9.3,35.1 9,35.4 SYMBOL.2
  Bottom 0.254: v42,46.8 36.9,41.7 11.1,41.7 9,39.6 9,35.7 SYMBOL.2 | v163.5,77.4 163.2,77.7 132.9,77.7 127.2,72 114,72 113.7,72.3 56.7,72.3 51.3,77.7 v47.7,77.7
VCC  (via drill 0.61)
  Top 0.254: 39.6,87.6 IC1.7 39.6,87.9 40.2,88.5 40.2,89.1 41.7,90.6 41.7,95.1 IC1.21 42,95.4 44.4,95.4 IC1.20 | LED1.VDD 174,90 166.8,90 166.8,88.2 C2.1 | R1.2 67.2,96.3 63.9,93 63.9,91.5 62.4,90 C3.1 62.1,90 62.1,86.4 C1.1 62.4,86.4 64.2,88.2 64.2,89.1 68.7,93.6 82.8,93.6 86.1,90.3 ISP.2 | v120.9,84.6 120,83.7 119.1,83.7 v115.2,87.6
  Bottom 0.254: PS/2.4 16.8,95.4 18.6,97.2 24.3,97.2 25.2,96.3 25.2,92.7 39.9,92.7 41.7,94.5 41.7,95.1 IC1.21 | v120.9,84.6 163.2,84.6 166.5,87.9 C2.1 | v115.2,87.6 113.4,89.4 94.8,89.4 92.7,91.5 87.3,91.5 86.1,90.3 ISP.2 | IC1.20 44.4,95.4 44.4,98.1 63.3,98.1 65.1,96.3 67.2,96.3 R1.2
VSS
  pour Bottom: 1.27,8 1.27,92 arc-90 8,99.06 182,99.06 arc-90 189,92 189,7 arc-90 181.05,1.27 8,1.27 arc-90
  pour Top: 1.27,8 1.27,92 arc-90 8,99.06 182,99.06 arc-90 189,92 189,7 arc-90 181,1.27 8,1.27 arc-90

### Text on the board
tNames: FN | LED | Sym | Res | GND | GND | CLK | DAT | VCC | Shift | PS/2 DIY-Keyboard | V1.1 02/2024 | Zille-Soft